# EAGLE design USB_Circuit (EAGLE 9.3.1)
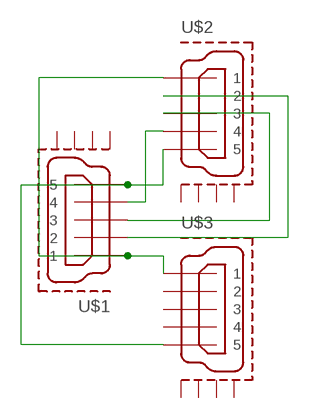
[diagram p0: schematic, sheet 1]

## Parts
U$1  MICRO-USB-RECEPTACLE47589-0001  [47589-0001]
U$2  MICRO-USB-RECEPTACLE47589-0001  [47589-0001]
U$3  MICRO-USB-RECEPTACLE47589-0001  [47589-0001]

## Nets
N$1: U$1.5 U$2.5 U$3.5
N$3: U$1.3 U$2.3
N$4: U$1.2 U$2.2
N$5: U$1.4 U$2.4
N$6: U$1.1 U$2.1 U$3.1
Unconnected: U$1.CASING1(GND1) U$1.CASING2(GND2) U$1.CASING3(GND3) U$1.CASING4(GND4) U$2.CASING1(GND1) U$2.CASING2(GND2) U$2.CASING3(GND3) U$2.CASING4(GND4) U$3.2 U$3.3 U$3.4 U$3.CASING1(GND1) U$3.CASING2(GND2) U$3.CASING3(GND3) U$3.CASING4(GND4)

## Library data of the parts
U$1-U$3 = Micro_USB:MICRO-USB-RECEPTACLE: MICRO USB RECEPTACLES Micro-USB Receptacles, SMT, Lead-Free from MOLEX <http://www.molex.com/>. (C) 2014 Tomasz Boleslaw CEDRO, cederom@tlen.pl, http://www.tomek.cedro.info. Version 0.1 (2014-01-17): Initial release. Version 0.2 (2014-02-06): Updated 47589-0001 footprint pins/pads/milling. Following devices are included: 1. 47589-0001 Micro-USB AB Receptacle, Bottom Mount, SMT, Lead-Free <http://www.molex.com/molex/products/datasheet.jsp?part=active/0475890001_IO_CONNECTORS.xml> (Technical Drawing <http://www.molex.com/pdm_docs/sd/475890001_sd.pdf>).

## Board
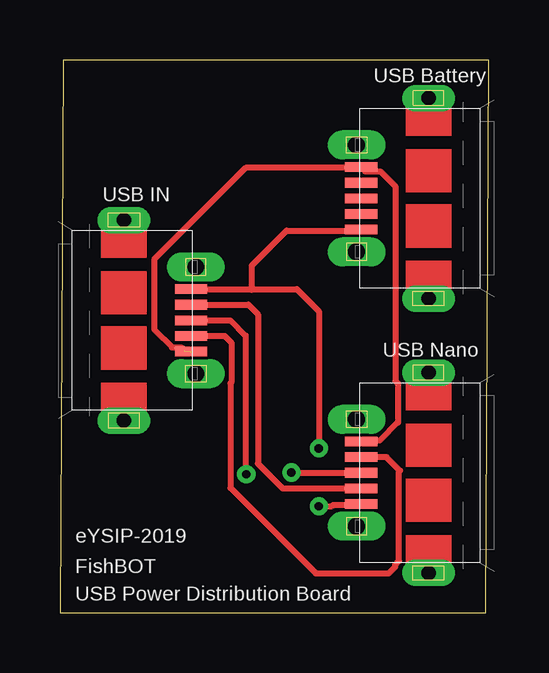
[diagram p1: board, top side]
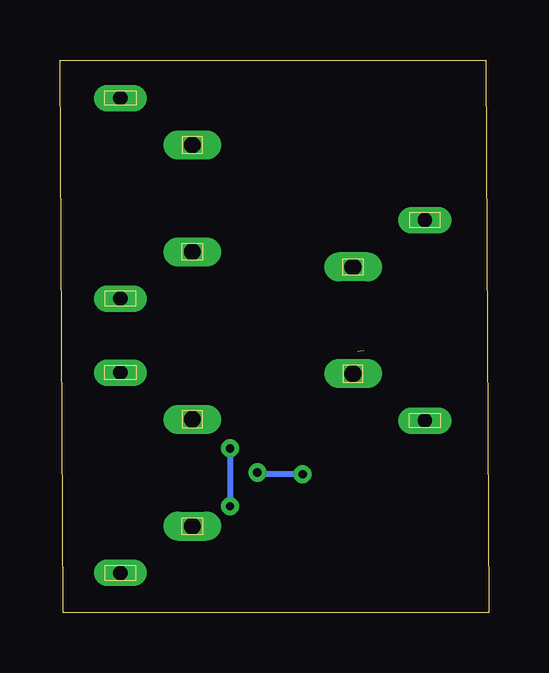
[diagram p2: board, bottom side, seen from below]

Size 17.89 x 23.04 mm. Coordinates in mm from the lower left corner, seen from the top.
Outline: 0,0 17.76,0 17.89,23.04 0.13,23.04 0,0
Copper layers (1*16): Top 0.035mm / dielectric 1.5mm / Bottom 0.035mm
Design rules "default": minimum track width 6mil, minimum drill 0.35mm, track to track 6mil, track to pad 6mil, pad to pad 6mil, via to via 6mil, smd to smd 6mil, copper to edge 40mil, drill to drill 6mil, minimum pad ring 10mil, minimum via ring 8mil, stop-mask expansion 4mil, vias tented up to drill 0mil, thermal gap 10mil

### Footprints (pad centres in the part's own frame; a part is rotated, then mirrored left to right if it is on the bottom)
47589-0001 = smd 1.35 x 0.4: 1 2.8,1.3; 2 2.8,0.65; 3 2.8,0; 4 2.8,-0.65; 5 2.8,-1.3 | drill 0.6 pad 0.95 long: CASING1 0,4.175; CASING2 0,-4.175 | drill 0.7 pad 1.1 long: CASING3 3,2.225; CASING4 3,-2.225

### Placement (x,y rotation side)
U$1  2.67,12.19 0 top
U$2  15.37,5.84 180 top
U$3  15.37,17.27 180 top

### Tracks (layer width: path | path; a pad name or v marks a point on that pad's centre or on a via)
N$1  (1 unrouted)
  Top 0.254: U$2.5 12.61,7.18 13.34,7.18 14.1,7.94 14.1,9.55 13.98,9.67 13.98,17.78 13.36,18.4 12.74,18.4 U$3.5 12.54,18.54 7.75,18.54 3.94,14.73 3.94,11.8 4.68,11.06 5.07,11.06 5.21,10.92
N$3  (via drill 0.35)
  Top 0.254: U$1.3 7.11,12.19 7.75,11.56 7.75,5.84 7.77,5.82 v7.77,5.78 | v9.65,5.85 v9.66,5.84 U$2.3
  Bottom 0.254: v7.77,5.78 9.59,5.78 9.65,5.71 v9.65,5.85
N$4
  Top 0.254: U$1.2 7.86,12.84 8.26,12.45 8.26,6.22 9.29,5.19 U$2.2
N$5
  Top 0.254: U$1.4 6.87,11.54 7.15,11.26 7.15,9.6 7.11,9.56 7.11,5.21 10.67,1.65 13.72,1.65 13.98,1.92 13.98,2.01 14.14,2.17 14.14,5.88 14.18,5.93 13.62,6.49 U$2.4
N$6  (via drill 0.35)
  Top 0.254: U$1.1 7.97,13.49 | 7.97,13.49 8,13.46 | 7.97,13.49 9.88,13.49 10.79,12.57 v10.79,6.86 | v10.79,4.45 11.34,4.45 11.4,4.5 12.53,4.5 U$2.1 | 7.97,13.49 8,13.52 8,14.48 9.45,15.93 12.53,15.93 U$3.1
  Bottom 0.254: v10.79,6.86 v10.79,4.45

### Text on the board
tPlace: USB Battery | USB IN | USB Nano | eYSIP-2019 | FishBOT | USB Power Distribution Board